# Altium schematic sheet Task with ESP32.SchDoc
size A3
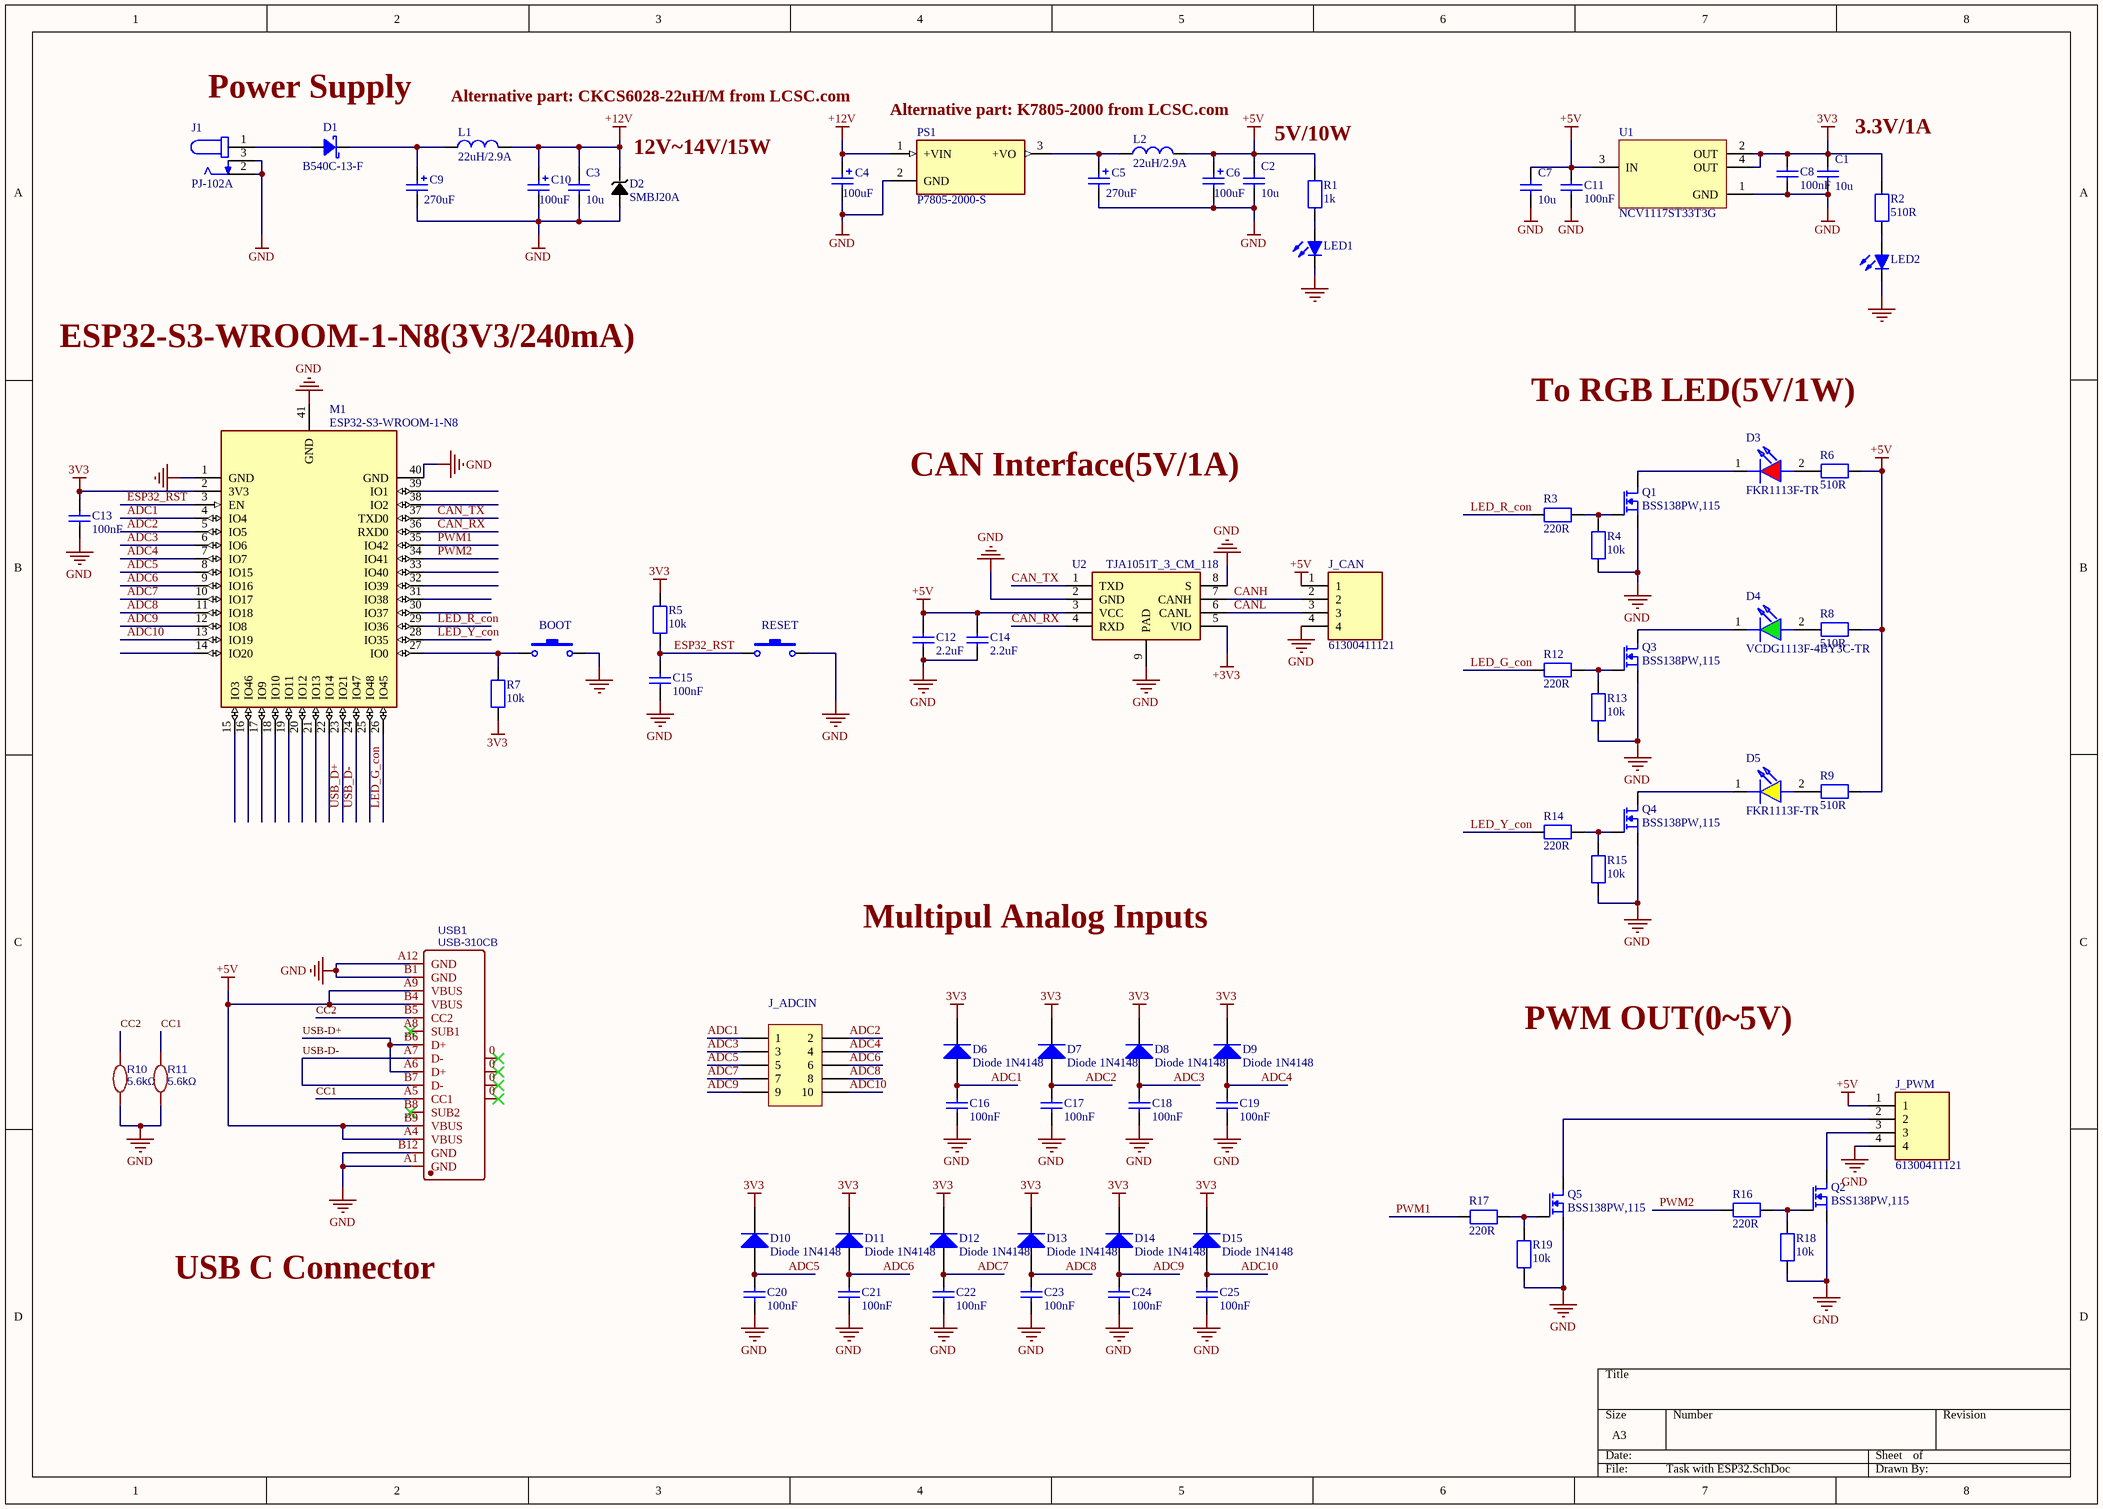
[diagram p0: Task with ESP32.SchDoc]

## Parts
BOOT  TL3305BF260QG  [SW_TL3305BF260QG]  (value not drawn)
C1  10u  [C1206]
C2  10u  [C1206]
C3  10u  [C1206]
C4  100uF  [CAP_EEUFC1E101S]
C5  270uF  [CAP_EEU-FK1E271B]
C6  100uF  [CAP_EEUFC1E101S]
C7  10u  [C1206]
C8  100nF  [C0603]
C9  270uF  [CAP_EEU-FK1E271B]
C10  100uF  [CAP_EEUFC1E101S]
C11  100nF  [C0603]
C12  2.2uF  [C0603]
C13  100nF  [C0603]
C14  2.2uF  [C0603]
C15  100nF  [C0603]
C16  100nF  [C0402]
C17  100nF  [C0402]
C18  100nF  [C0402]
C19  100nF  [C0402]
C20  100nF  [C0402]
C21  100nF  [C0402]
C22  100nF  [C0402]
C23  100nF  [C0402]
C24  100nF  [C0402]
C25  100nF  [C0402]
D1  B540C-13-F  [DO-214AB2]
D2  SMBJ20A  [DO-214AA2]
D3  FKR1113F-TR  [VCDG1113F4BY3CTR]
D4  VCDG1113F-4BY3C-TR  [VCDG1113F4BY3CTR]
D5  FKR1113F-TR  [VCDG1113F4BY3CTR]
D6  Diode 1N4148  [DO-35]
D7  Diode 1N4148  [DO-35]
D8  Diode 1N4148  [DO-35]
D9  Diode 1N4148  [DO-35]
D10  Diode 1N4148  [DO-35]
D11  Diode 1N4148  [DO-35]
D12  Diode 1N4148  [DO-35]
D13  Diode 1N4148  [DO-35]
D14  Diode 1N4148  [DO-35]
D15  Diode 1N4148  [DO-35]
J1  PJ-102A  [CUI_PJ-102A]
J_ADCIN  (no value)  [HDR2X5H]
J_CAN  61300411121  [61300411121]
J_PWM  61300411121  [61300411121]
L1  22uH/2.9A  [IND_SRP6030]
L2  22uH/2.9A  [IND_SRP6030]
LED1  SML-D12U1WT86  [LED0603]  (value not drawn)
LED2  SML-D12U1WT86  [LED0603]  (value not drawn)
M1  ESP32-S3-WROOM-1-N8  [ESP32-S3-WROOM-1-N8]
PS1  P7805-2000-S  [CONV_P7805-2000-S]
Q1  BSS138PW,115  [SOT323-3]
Q2  BSS138PW,115  [SOT323-3]
Q3  BSS138PW,115  [SOT323-3]
Q4  BSS138PW,115  [SOT323-3]
Q5  BSS138PW,115  [SOT323-3]
R1  1k  [R0603]
R2  510R  [R0603]
R3  220R  [R0603]
R4  10k  [R0603]
R5  10k  [R0603]
R6  510R  [R0603]
R7  10k  [R0603]
R8  510R  [R0603]
R9  510R  [R0603]
R10  5.6kΩ  [R0201]
R11  5.6kΩ  [R0201]
R12  220R  [R0603]
R13  10k  [R0603]
R14  220R  [R0603]
R15  10k  [R0603]
R16  220R  [R0603]
R17  220R  [R0603]
R18  10k  [R0603]
R19  10k  [R0603]
RESET  TL3305BF260QG  [SW_TL3305BF260QG]  (value not drawn)
U1  NCV1117ST33T3G  [SOT223-3]
U2  TJA1051T_3_CM_118  [SOIC127P600X175-8N]
USB1  USB-310CB  [USB-C-SMD_20P-P0.50-L6.5-W11.2]

## Nets
3V3: C1.2 C8.2 C13.2 D6.2(K) D7.2(K) D8.2(K) D9.2(K) D10.2(K) D11.2(K) D12.2(K) D13.2(K) D14.2(K) D15.2(K) M1.2(3V3) R2.2 R5.2 R7.2 U1.2(OUT) U1.4(OUT)
+3V3: U2.5(VIO)
+5V: C2.2 C6.1 C7.2 C11.2 C12.2 C14.2 J_CAN.1 J_PWM.1 L2.2 R1.2 R6.1 R8.1 R9.1 U1.3(IN) U2.3(VCC) USB1.A4(VBUS) USB1.A9(VBUS) USB1.B4(VBUS) USB1.B9(VBUS)
+12V: C3.2 C4.1 C10.1 D2.C L1.2 PS1.1(+VIN)
GND: BOOT.2 C1.1 C2.1 C3.1 C4.2 C5.2 C6.2 C7.1 C8.1 C9.2 C10.2 C11.1 C12.1 C13.1 C14.1 C15.1 C16.1 C17.1 C18.1 C19.1 C20.1 C21.1 C22.1 C23.1 C24.1 C25.1 D2.A J1.2 J1.3 J_CAN.4 J_PWM.4 LED1.C LED2.C M1.1(GND) M1.40(GND) M1.41(GND) PS1.2(GND) Q1.2(S) Q2.2(S) Q3.2(S) Q4.2(S) Q5.2(S) R4.1 R10.2 R11.1 R13.1 R15.1 R18.1 R19.1 RESET.2 U1.1(GND) U2.2(GND) U2.8(S) U2.9(PAD) USB1.A1(GND) USB1.A12(GND) USB1.B1(GND) USB1.B12(GND)
ADC1: C16.2 D6.1(A) J_ADCIN.1 M1.4(IO4)
ADC2: C17.2 D7.1(A) J_ADCIN.2 M1.5(IO5)
ADC3: C18.2 D8.1(A) J_ADCIN.3 M1.6(IO6)
ADC4: C19.2 D9.1(A) J_ADCIN.4 M1.7(IO7)
ADC5: C20.2 D10.1(A) J_ADCIN.5 M1.8(IO15)
ADC6: C21.2 D11.1(A) J_ADCIN.6 M1.9(IO16)
ADC7: C22.2 D12.1(A) J_ADCIN.7 M1.10(IO17)
ADC8: C23.2 D13.1(A) J_ADCIN.8 M1.11(IO18)
ADC9: C24.2 D14.1(A) J_ADCIN.9 M1.12(IO8)
ADC10: C25.2 D15.1(A) J_ADCIN.10 M1.13(IO19)
CAN_RX: M1.36(RXD0) U2.4(RXD)
CAN_TX: M1.37(TXD0) U2.1(TXD)
CANH: J_CAN.2 U2.7(CANH)
CANL: J_CAN.3 U2.6(CANL)
CC1: R11.2 USB1.A5(CC1)
CC2: R10.1 USB1.B5(CC2)
ESP32_RST: C15.2 M1.3(EN) R5.1 RESET.1
LED_G_con: M1.26(IO45) R12.1
LED_R_con: M1.29(IO36) R3.1
LED_Y_con: M1.28(IO35) R14.1
PWM1: M1.35(IO42) R17.1
PWM2: M1.34(IO41) R16.1
USB-D+: USB1.A6(D+) USB1.B6(D+)
USB-D-: USB1.A7(D-) USB1.B7(D-)
USB_D+: M1.23(IO21)
USB_D-: M1.24(IO47)
NetBOOT_1: BOOT.1 M1.27(IO0) R7.1
NetC5_1: C5.1 L2.1 PS1.3(+VO)
NetC9_1: C9.1 D1.C L1.1
NetD1_A: D1.A J1.1
NetD3_1: D3.1(K) Q1.3(D)
NetD3_2: D3.2(A) R6.2
NetD4_1: D4.1(K) Q3.3(D)
NetD4_2: D4.2(A) R8.2
NetD5_1: D5.1(K) Q4.3(D)
NetD5_2: D5.2(A) R9.2
NetJ_PWM_2: J_PWM.2 Q5.3(D)
NetJ_PWM_3: J_PWM.3 Q2.3(D)
NetLED1_A: LED1.A R1.1
NetLED2_A: LED2.A R2.1
NetQ1_1: Q1.1(G) R3.2 R4.2
NetQ2_1: Q2.1(G) R16.2 R18.2
NetQ3_1: Q3.1(G) R12.2 R13.2
NetQ4_1: Q4.1(G) R14.2 R15.2
NetQ5_1: Q5.1(G) R17.2 R19.2

Not connected (* = marked no-connect by the designer): M1 14(IO20) 15(IO3) 16(IO46) 17(IO9) 18(IO10) 19(IO11) 20(IO12) 21(IO13) 22(IO14) 25(IO48) 30(IO37) 31(IO38) 32(IO39) 33(IO40) 38(IO2) 39(IO1); USB1 0* A8(SUB1)* B8(SUB2)*

## Notes on the sheet
- Power Supply
- (near L1) Alternative part: CKCS6028-22uH/M from LCSC.com
- (near D2) 12V~14V/15W
- Alternative part: K7805-2000 from LCSC.com
- 5V/10W
- 3.3V/1A
- ESP32-S3-WROOM-1-N8(3V3/240mA)
- To RGB LED(5V/1W)
- CAN Interface(5V/1A)
- Multipul Analog Inputs
- PWM OUT(0~5V)
- USB C Connector

## Library data of the parts
BOOT RESET = TL3305BF260QG: SWITCH TACTILE SPST-NO 0.05A 12V; Manufacturer: E-Switch; Value: TL3305BF260QG; Manufacturer Part Number: TL3305BF260QG; Supplier: Mouser; Supplier Part Number: 612-TL3305BF260QG; Price: 0.25
C1-C3 C7 = 10uF ± 10% 25V: Manufacturer: Yageo; Manufacturer Part Number: CC1206KKX7R8BB106; Tolerance: +-10%; Type: X7R; Voltage (V): 25; Category: Capacitor; Value: 10u; Price: 0.44; Supplier: Mouser; Supplier Part Number: 603-CC126KKX7R8BB106
C4 C6 C10 = EEU-FC1E101S: CAP ALUM 100UF 20% 25V SMD; Manufacturer: Panasonic; Manufacturer Part Number: EEU-FC1E101S; Value: 100uF; Supplier: Mouser; Supplier Part Number: 667-EEU-FC1E101S; Price: 0.4
C5 C9 = EEU-FC1E271B: CAP ALUM 270UF 20% 25V SMD; Manufacturer: Panasonic; Manufacturer Part Number: EEU-FC1E271B; Value: 270uF; Supplier: Mouser; Supplier Part Number: 667-EEU-FC1E271B; Price: 0.7
C8 C11 C13 C15 = 100nF ± 10% 50V: Manufacturer: Yageo; Manufacturer Part Number: CC0603KRX7R9BB104; Value: 100nF; Supplier: Mouser; Supplier Part Number: 603-CC603KRX7R9BB104; Price: 0.1
C12 C14 = 2.2uF ± 10% 50V: Manufacturer: Yageo; Manufacturer Part Number: GRM188R61H225ME11J; Value: 2.2uF; Supplier: mouser; Supplier Part Number: 81-GRM188R61H225ME1J; Price: 0.3
C16-C25 = 100nF ± 10% 50V: Manufacturer: Yageo; Manufacturer Part Number: CS0603KRX7R9BB104; Value: 100nF; Supplier: mouser; Supplier Part Number: 603-CS0603KRX79BB104; Price: 0.1
D1 = B540C-13-F: Schottky Diodes & Rectifiers 40V 5A; Value: B540C-13-F; Manufacturer Part Number: B540C-13-F; Manufacturer: Diodes; Supplier: Mouser; Supplier Part Number: 621-B540C-F; Price: 0.5
D2 = ZM4746A-GS08: ESD Suppressors / TVS Diodes 600W, 23.4V, 5%, Unidirectional, TVS; Manufacturer: Littelfuse; Value: SMBJ20A; Manufacturer Part Number: SMBJ20A; Supplier: Mouser; Supplier Part Number: 576-SMBJ20A; Price: 0.35
D3 = LED_RED: R/A LED; Manufacturer: Stanley Electric; Value: Red; Supplier Part Number: 327-FKR1113FTR; Supplier: Mouser; Manufacturer Part Number: FKR1113F-TR; Price: 0.5
D4 = LED_GREEN: R/A LED; Manufacturer: Stanley Electric; Value: Green; Supplier Part Number: 327-VCDG1113F4BY3CTR; Supplier: Mouser; Manufacturer Part Number: VCDG1113F-4BY3C-TR; Price: 0.5
D5 = LED_YELLOW: R/A LED; Manufacturer: Stanley Electric; Manufacturer Part Number: FKY1113F-TR; Value: Yellow; Supplier Part Number: 327-FKY1113FTR; Supplier: Mouser; Price: 0.5
D6-D15 = Diode 1N4148: High Conductance Fast Diode; Published: 8-Jun-2000; LatestRevisionDate: 17-Jul-2002; LatestRevisionNote: Re-released for DXP Platform.; DatasheetVersion: 1997; PackageReference: DO-35; Publisher: Altium Limited; PackageDescription: Diode, Axial; Body 3.8 x 1.9 mm (LxDia. max), Lead Dia. 0.53 mm (max); Code_JEDEC: DO-204-AH; ComponentLink1Description: Manufacturer Link; ComponentLink1URL: http://www.fairchildsemi.com/; ComponentLink2Description: Datasheet; ComponentLink2URL: http://www.fairchildsemi.com/ds/1N%2F1N4148.pdf
J1 = PJ-102A: CONN PWR JACK 2X5.5MM SOLDER; Manufacturer: CUI Devices; Manufacturer Part Number: PJ-102A; Value: PJ-102A; Supplier: Mouser; Supplier Part Number: 490-PJ-102A; Price: 0.8
J_ADCIN = Header 5X2H: Header, 5-Pin, Dual row, Right Angle; LatestRevisionDate: 17-Jul-2002; LatestRevisionNote: Re-released for DXP Platform.; Publisher: Altium Limited
J_CAN J_PWM = Header 4 Pin: Headers & Wire Housings WR-PHD 2.54mm Hdr 4P Single Str Gold; Manufacturer: Wurth Electronic; Supplier Part Number: 710-61300411121; Supplier: Mouser; Manufacturer Part Number: 61300411121; Price: 0.19; Value: 61300411121
L1 L2 = SRP6030WA-220M: Power Inductors - SMD Ind,7.1x6.6x2.8mm,22uH+/-20%,2.9A,shd; Manufacturer: Bourns; Manufacturer Part Number: SRP6030WA-220M; Value: 22uH/2.9A; Supplier: Mouser; Supplier Part Number: 652-SRP6030WA-220M; Price: 1.2
LED1 LED2 = SML-D12U1WT86: Typical RED GaAs LED; Manufacturer: Rohm Semiconductor; Supplier: Mouser; Supplier Part Number: 755-SML-D12U1WT86; Manufacturer Part Number: SML-D12U1WT86; Value: SML-D12U1WT86; Price: 0.2
M1 = ESP32-S3-WROOM-1-N8: Bluetooth, WiFi 802.11b/g/n, Bluetooth v5.0 Transceiver Module 2.4GHz PCB Trace Surface Mount; Manufacturer: Espressif Systems; Price: 3.45; Value: ESP32-S3-WROOM-1-N8; Supplier Part Number: 356-ESP32-S3WROOM1N8; Manufacturer Part Number: ESP32-S3-WROOM-1-N8; Supplier: Mouser
PS1 = P7805-2000-S: 2 A Output Current, 6~36 Vdc Input, SIP, Non-Isolated, Dc-Dc Converter; Manufacturer: CUI Inc.; Price: 6.5; Supplier: Mouser; Value: P7805-2000-S; Supplier Part Number: 490-P7805-2000-S; Manufacturer Part Number: P7805-2000-S
Q1-Q5 = BSS138PW,115: MOSFET, N CH, 60V, 0.2A; Manufacturer: Nexperia; Value: BSS138PW,115; Manufacturer Part Number: BSS138PW,115; Supplier: Mouser; Supplier Part Number: 771-BSS138PW115; Price: 0.3
R1 = 1 kOhms ±1% 0.1W: Manufacturer: Yageo; Manufacturer Part Number: RC0603FR-071KL; Value: 1k; Supplier: Mouser; Supplier Part Number: 603-RC0603FR-071KL; Price: 0.1
R2 R6 R8 R9 = 510 Ohm ±1% 0.1W: Manufacturer: Yageo; Manufacturer Part Number: RC0603FR-07510RL; Value: 510R; Supplier: Mouser; Supplier Part Number: 603-RC0603FR-07510RL; Price: 0.1
R3 R12 R14 R16 R17 = 220 Ohm ±1% 0.1W: Manufacturer: Yageo; Manufacturer Part Number: RC0603FR-07220RL; Value: 220R; Supplier: Mouser; Supplier Part Number: 603-RC0603FR-07220RL; Price: 0.1
R4 R5 R7 R13 R15 R18 R19 = 10 kOhms ±1% 0.1W: Manufacturer: Yageo; Manufacturer Part Number: RC0603FR-0710KL; Value: 10k; Supplier: Mouser; Supplier Part Number: 603-RC0603FR-0710KL; Price: 0.1
R10 R11 = 5.6kΩ: Manufacturer: UNI-ROYAL(Uniroyal Elec); Manufacturer Part: NQ01WMJ0562TEE; Contributor: LCSC; nameAlias: Resistance; Supplier: LCSC; Supplier Part: C965305; spicePre: R; spiceSymbolName: NQ01WMJ0562TEE
U1 = NCV1117ST33T3G: LDO Voltage Regulators 3.3V 1.0A Automotive; Manufacturer: onsemi; Price: 0.7; Manufacturer Part Number: NCV1117ST33T3G; Supplier Part Number: 863-NCV1117ST33T3G; Value: NCV1117ST33T3G; Supplier: Mouser
U2 = TJA1051T_3_CM_118: CAN Interface IC BL Advanced Automotive Analog; Manufacturer: NXP Semiconductors; Manufacturer Part Number: TJA1051T/3/CM,118; Value: TJA1051T/3/CM,118; Supplier Part Number: 771-TJA1051T/3CM118; Supplier: Mouser; Price: 1.6
USB1 = USB-310CB: Manufacturer: HOOYA; Contributor: LCSC; Supplier: LCSC; Supplier Part: C309373; Manufacturer Part: USB-310CB; spicePre: U; spiceSymbolName: USB-310CB